# Altium schematic sheet SubBus8.SchDoc
size A
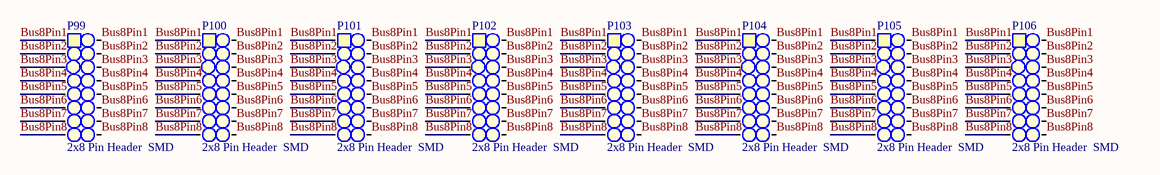
[diagram p0: SubBus8.SchDoc]

## Parts
P99  2x8 Pin Header  SMD  [2X8_SMD_PH_2.54]
P100  2x8 Pin Header  SMD  [2X8_SMD_PH_2.54]
P101  2x8 Pin Header  SMD  [2X8_SMD_PH_2.54]
P102  2x8 Pin Header  SMD  [2X8_SMD_PH_2.54]
P103  2x8 Pin Header  SMD  [2X8_SMD_PH_2.54]
P104  2x8 Pin Header  SMD  [2X8_SMD_PH_2.54]
P105  2x8 Pin Header  SMD  [2X8_SMD_PH_2.54]
P106  2x8 Pin Header  SMD  [2X8_SMD_PH_2.54]

## Nets
Bus8Pin1: P99.1 P99.16 P100.1 P100.16 P101.1 P101.16 P102.1 P102.16 P103.1 P103.16 P104.1 P104.16 P105.1 P105.16 P106.1 P106.16
Bus8Pin2: P99.2 P99.15 P100.2 P100.15 P101.2 P101.15 P102.2 P102.15 P103.2 P103.15 P104.2 P104.15 P105.2 P105.15 P106.2 P106.15
Bus8Pin3: P99.3 P99.14 P100.3 P100.14 P101.3 P101.14 P102.3 P102.14 P103.3 P103.14 P104.3 P104.14 P105.3 P105.14 P106.3 P106.14
Bus8Pin4: P99.4 P99.13 P100.4 P100.13 P101.4 P101.13 P102.4 P102.13 P103.4 P103.13 P104.4 P104.13 P105.4 P105.13 P106.4 P106.13
Bus8Pin5: P99.5 P99.12 P100.5 P100.12 P101.5 P101.12 P102.5 P102.12 P103.5 P103.12 P104.5 P104.12 P105.5 P105.12 P106.5 P106.12
Bus8Pin6: P99.6 P99.11 P100.6 P100.11 P101.6 P101.11 P102.6 P102.11 P103.6 P103.11 P104.6 P104.11 P105.6 P105.11 P106.6 P106.11
Bus8Pin7: P99.7 P99.10 P100.7 P100.10 P101.7 P101.10 P102.7 P102.10 P103.7 P103.10 P104.7 P104.10 P105.7 P105.10 P106.7 P106.10
Bus8Pin8: P99.8 P99.9 P100.8 P100.9 P101.8 P101.9 P102.8 P102.9 P103.8 P103.9 P104.8 P104.9 P105.8 P105.9 P106.8 P106.9

## Library data of the parts
P99-P106 = 2x8 Pin Header  SMD: 2.54mm, SMD; Value: 2x8 Pin Header, 2.54mm, SMD; Farnell: 2356242